# Altium schematic sheet push_button.SchDoc
size A4; Engineer: Amir Hossein Jobeiri; Organization: Simaran; SheetNumber: 9; SheetTotal: 23
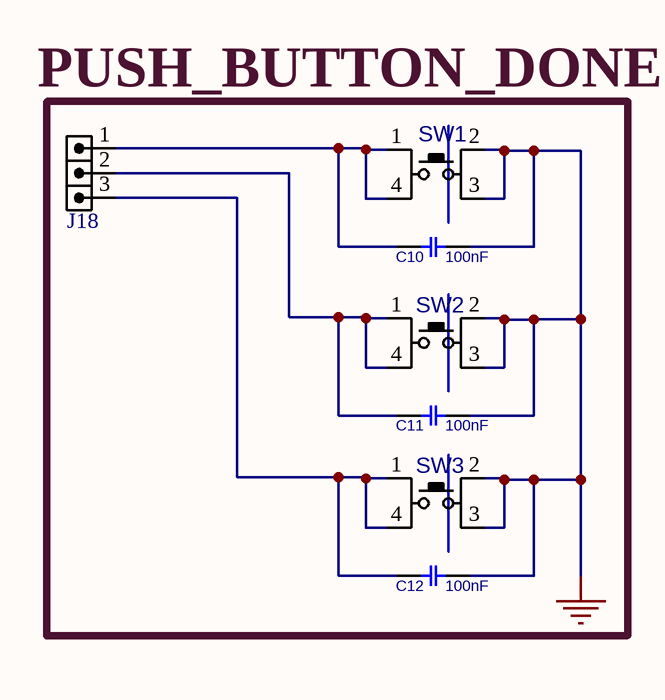
[diagram p0: push_button.SchDoc]

## Parts
C10  100nF  [C_CER_D3]
C11  100nF  [C_CER_D3]
C12  100nF  [C_CER_D3]
J18  HDRMINI_3  [HDRMINI_M_1X3]  (value not drawn)
SW1  PUSHBUTTON  [SWPBT_SPDT_6X6X5]  (value not drawn)
SW2  PUSHBUTTON  [SWPBT_SPDT_6X6X5]  (value not drawn)
SW3  PUSHBUTTON  [SWPBT_SPDT_6X6X5]  (value not drawn)

## Nets
GND: C10.2 C11.2 C12.2 SW1.2(P3) SW1.3(P4) SW2.2(P3) SW2.3(P4) SW3.2(P3) SW3.3(P4)
NetC10_1: C10.1 J18.1 SW1.1(P1) SW1.4(P2)
NetC11_1: C11.1 J18.2 SW2.1(P1) SW2.4(P2)
NetC12_1: C12.1 J18.3 SW3.1(P1) SW3.4(P2)

## Notes on the sheet
- PUSH_BUTTON_DONE

## Library data of the parts
C10-C12 = CAP_THD_CERML: CAP, THD, CER MULTI LAYER,; PARAM: 50V; DESC: CAP, CER MULTI LAYER,; MANF_P#: MANF_PART#; PRICE: 100= 1$; MANF: MANF; PARAM2: PARAM2; ASSEMBLY: ASSEMBLY; VALUE: 100nF
J18 = HDRMINI_M_1X3: CONN, HEADER, Male, pitch: 1.27mm, 3POS; VALUE: HDRMINI_3
SW1-SW3 = SWPBT_SPDT_6X6X5: SWITCH, PUSH BUTTON, TACTILE, THD, SPDT, 4X4MM; DESC: DESCRIPTION; MANF: -; VALUE: PUSHBUTTON; ASSEMBLY: ASSEMBLY; PARAM: PARAM; PRICE: PRICE; MANF_P#: -